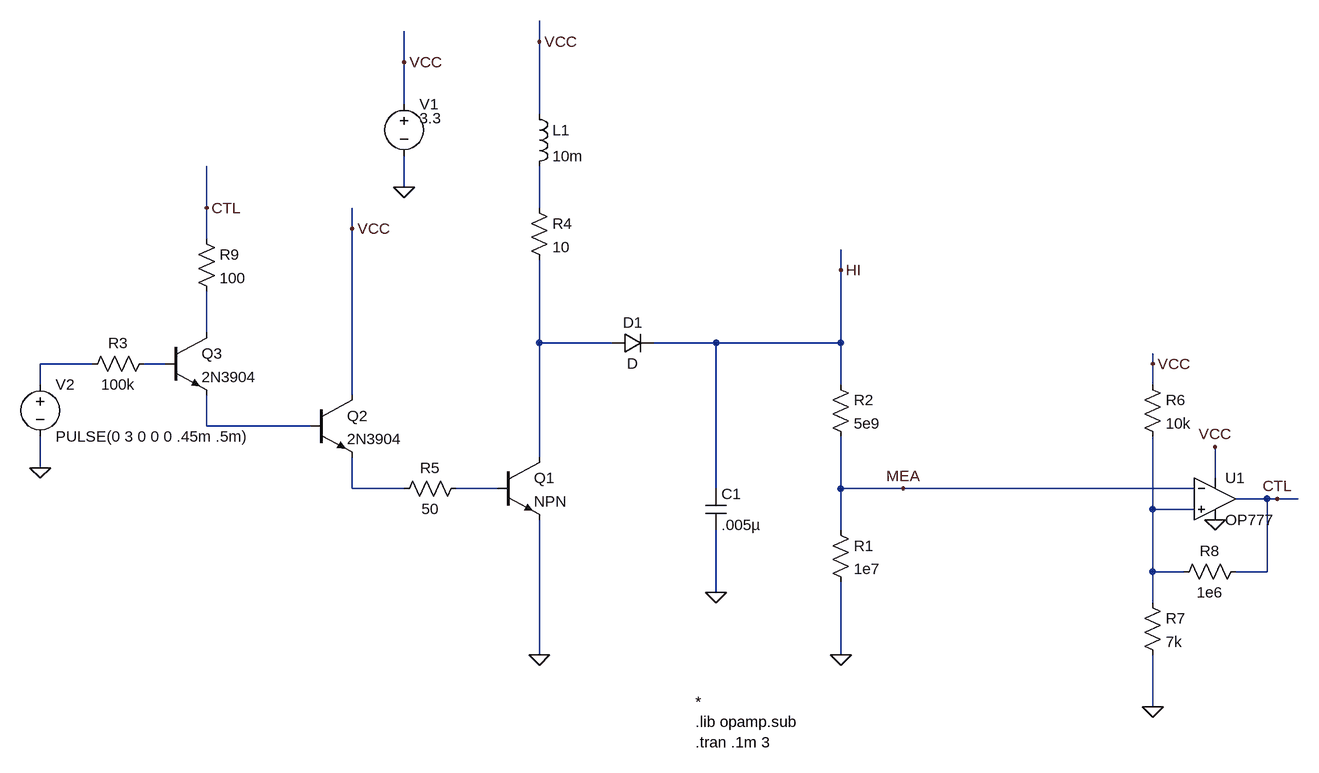
[diagram p0: schematic geiger_shield.asc]
geiger_shield.asc, the LTspice schematic file:
Version 4
SHEET 1 1380 1344
WIRE 208 -192 208 -224
WIRE 0 -160 0 -208
WIRE 0 -96 0 -160
WIRE 208 -80 208 -192
WIRE 0 32 0 -16
WIRE -304 64 -304 0
WIRE 208 64 208 0
WIRE -80 96 -80 64
WIRE -304 112 -304 64
WIRE 672 160 672 128
WIRE -304 256 -304 192
WIRE 208 272 208 144
WIRE 320 272 208 272
WIRE 480 272 384 272
WIRE 672 272 672 160
WIRE 672 272 480 272
WIRE -480 304 -560 304
WIRE -368 304 -400 304
WIRE 1152 304 1152 288
WIRE -560 336 -560 304
WIRE 672 336 672 272
WIRE 1152 336 1152 304
WIRE -80 352 -80 96
WIRE -304 400 -304 352
WIRE -144 400 -304 400
WIRE 208 448 208 272
WIRE -560 464 -560 416
WIRE 1248 480 1248 432
WIRE -80 496 -80 448
WIRE 0 496 -80 496
WIRE 144 496 80 496
WIRE 480 496 480 272
WIRE 672 496 672 416
WIRE 768 496 672 496
WIRE 1216 496 768 496
WIRE 1328 512 1280 512
WIRE 1344 512 1328 512
WIRE 1376 512 1344 512
WIRE 1152 528 1152 416
WIRE 1216 528 1152 528
WIRE 672 560 672 496
WIRE 1152 624 1152 528
WIRE 1200 624 1152 624
WIRE 1328 624 1328 512
WIRE 1328 624 1280 624
WIRE 480 656 480 560
WIRE 1152 672 1152 624
WIRE 208 752 208 544
WIRE 672 752 672 640
WIRE 1152 832 1152 752
FLAG 208 752 0
FLAG 480 656 0
FLAG 0 32 0
FLAG 0 -160 VCC
FLAG -560 464 0
FLAG 1152 832 0
FLAG 1344 512 CTL
FLAG 208 -192 VCC
FLAG 672 160 HI
FLAG 1152 304 VCC
FLAG 1248 432 VCC
FLAG 1248 544 0
FLAG -80 96 VCC
FLAG -304 64 CTL
FLAG 672 752 0
FLAG 768 496 MEA
SYMBOL ind 192 -96 R0
SYMATTR InstName L1
SYMATTR Value 10m
SYMBOL cap 464 496 R0
SYMATTR InstName C1
SYMATTR Value .005µ
SYMBOL res 656 320 R0
SYMATTR InstName R2
SYMATTR Value 5e9
SYMBOL res 192 48 R0
SYMATTR InstName R4
SYMATTR Value 10
SYMBOL voltage 0 -112 R0
WINDOW 3 24 38 Left 2
SYMATTR Value 3.3
SYMATTR InstName V1
SYMBOL voltage -560 320 R0
SYMATTR InstName V2
SYMATTR Value PULSE(0 3 0 0 0 .45m .5m)
SYMBOL diode 320 288 R270
WINDOW 0 32 32 VTop 2
WINDOW 3 0 32 VBottom 2
SYMATTR InstName D1
SYMBOL res 1136 320 R0
SYMATTR InstName R6
SYMATTR Value 10k
SYMBOL res 1136 656 R0
SYMATTR InstName R7
SYMATTR Value 7k
SYMBOL res 1296 608 R90
WINDOW 0 0 56 VBottom 2
WINDOW 3 32 56 VTop 2
SYMATTR InstName R8
SYMATTR Value 1e6
SYMBOL Opamps/OP777 1248 448 R0
SYMATTR InstName U1
SYMBOL npn 144 448 R0
SYMATTR InstName Q1
SYMBOL res 96 480 R90
WINDOW 0 0 56 VBottom 2
WINDOW 3 32 56 VTop 2
SYMATTR InstName R5
SYMATTR Value 50
SYMBOL res 656 544 R0
SYMATTR InstName R1
SYMATTR Value 1e7
SYMBOL npn -144 352 R0
SYMATTR InstName Q2
SYMATTR Value 2N3904
SYMBOL npn -368 256 R0
SYMATTR InstName Q3
SYMATTR Value 2N3904
SYMBOL res -384 288 R90
WINDOW 0 0 56 VBottom 2
WINDOW 3 32 56 VTop 2
SYMATTR InstName R3
SYMATTR Value 100k
SYMBOL res -320 96 R0
SYMATTR InstName R9
SYMATTR Value 100
TEXT 448 824 Left 2 !*\n.lib opamp.sub\n.tran .1m 3

The netlist it stands for:
* geiger_shield.asc
L1 VCC N001 10m
C1 HI 0 .005µ
R2 HI MEA 5e9
R4 N001 N003 10
V1 VCC 0 3.3
V2 N004 0 PULSE(0 3 0 0 0 .45m .5m)
D1 N003 HI D
R6 VCC N009 10k
R7 N009 0 7k
R8 CTL N009 1e6
XU1 N009 MEA VCC 0 CTL OP777  ; pins In+ In- V+ V- OUT
Q1 N003 N008 0 0 NPN
R5 N008 N007 50
R1 MEA 0 1e7
Q2 VCC N006 N007 0 2N3904
Q3 N002 N005 N006 0 2N3904
R3 N005 N004 100k
R9 CTL N002 100
.model D D
.lib standard.dio
.model NPN NPN
.model PNP PNP
.lib standard.bjt
*
.lib opamp.sub
.tran .1m 3
.lib ADI.lib
.backanno
.end